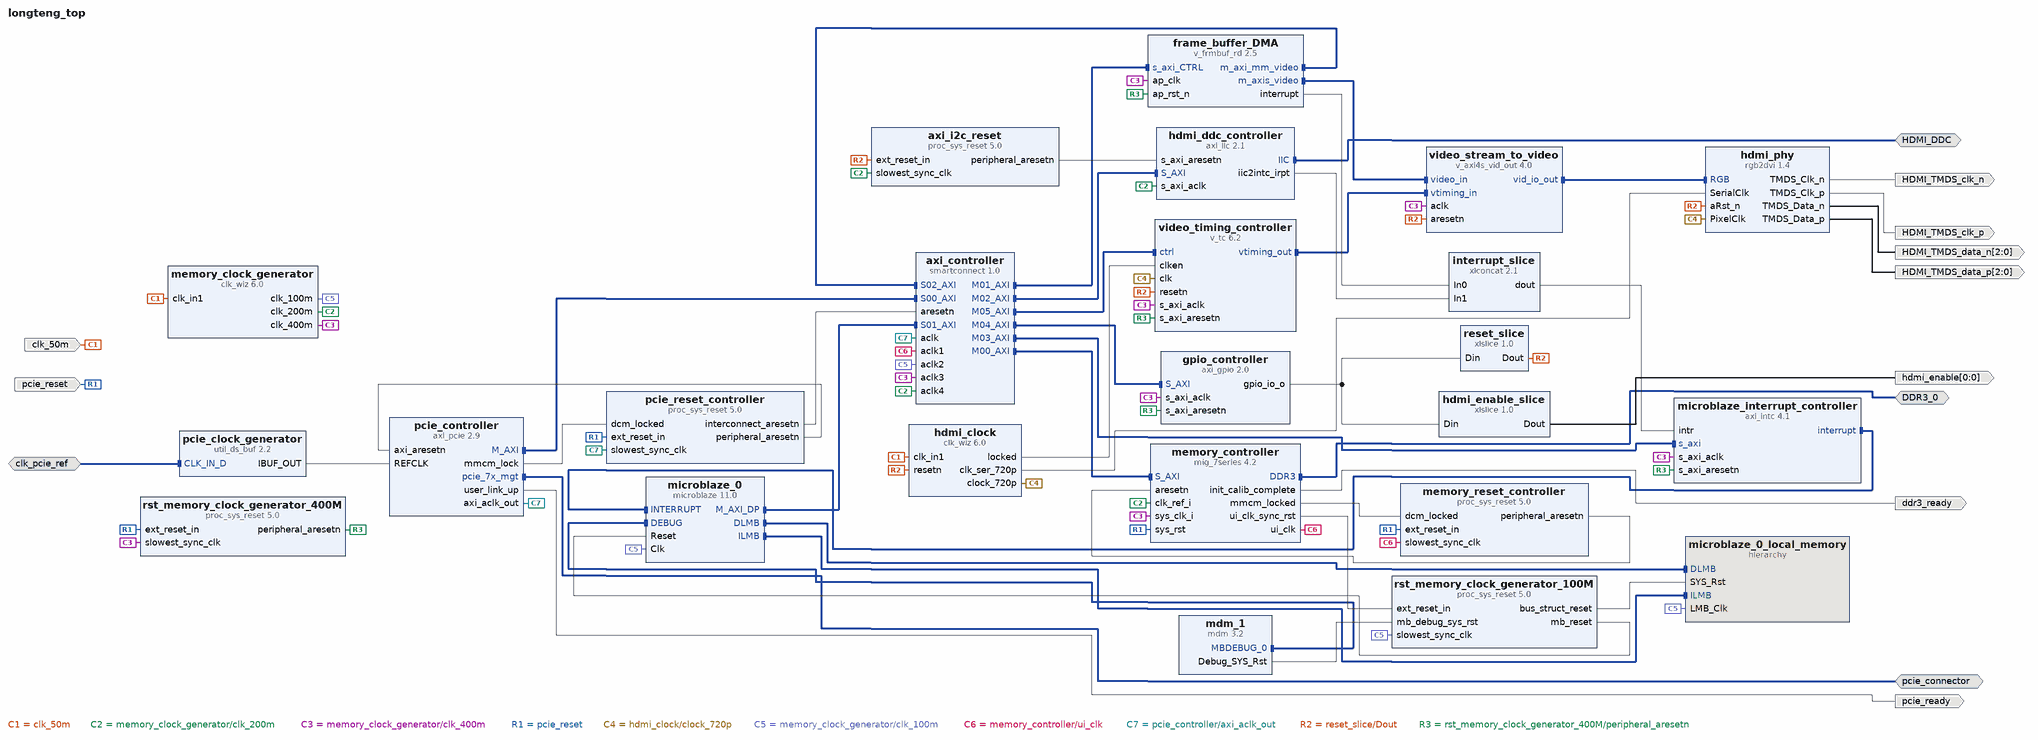
[diagram p0: block diagram of the top level]
# Vivado block design longteng_top, xc7k325tffg676-2, Vivado 2023.2
create_bd_design longteng_top

create_bd_intf_port -mode Slave -vlnv xilinx.com:interface:diff_clock_rtl:1.0 clk_pcie_ref
create_bd_intf_port -mode Master -vlnv xilinx.com:interface:pcie_7x_mgt_rtl:1.0 pcie_connector
create_bd_intf_port -mode Master -vlnv xilinx.com:interface:ddrx_rtl:1.0 DDR3_0
create_bd_intf_port -mode Master -vlnv xilinx.com:interface:iic_rtl:1.0 HDMI_DDC
create_bd_port -dir I -type rst pcie_reset
set_property -dict {CONFIG.POLARITY ACTIVE_LOW} [get_bd_ports pcie_reset]
create_bd_port -dir O pcie_ready
create_bd_port -dir O ddr3_ready
create_bd_port -dir I -type clk clk_50m
set_property -dict {CONFIG.FREQ_HZ 50000000} [get_bd_ports clk_50m]
create_bd_port -dir O -type clk HDMI_TMDS_clk_p
create_bd_port -dir O -type clk HDMI_TMDS_clk_n
create_bd_port -dir O -from 2 -to 0 HDMI_TMDS_data_p
create_bd_port -dir O -from 2 -to 0 HDMI_TMDS_data_n
create_bd_port -dir O -from 0 -to 0 hdmi_enable

create_bd_cell -type ip -vlnv xilinx.com:ip:axi_pcie:2.9 pcie_controller
set_property -dict [list \
  CONFIG.AXIBAR2PCIEBAR_0 0x00000000 \
  CONFIG.AXIBAR_AS_0 true \
  CONFIG.BAR0_SCALE Megabytes \
  CONFIG.BAR0_SIZE 128 \
  CONFIG.BAR_64BIT true \
  CONFIG.BASE_CLASS_MENU Display_controller \
  CONFIG.CLASS_CODE 0x030000 \
  CONFIG.DEVICE_ID 0xbeef \
  CONFIG.ENABLE_CLASS_CODE false \
  CONFIG.INTERRUPT_PIN false \
  CONFIG.MAX_LINK_SPEED 5.0_GT/s \
  CONFIG.M_AXI_DATA_WIDTH 128 \
  CONFIG.NO_OF_LANES X4 \
  CONFIG.NUM_MSI_REQ 1 \
  CONFIG.SUBSYSTEM_ID 0xbabe \
  CONFIG.SUBSYSTEM_VENDOR_ID 0xcafe \
  CONFIG.SUB_CLASS_INTERFACE_MENU VGA_compatible_controller \
  CONFIG.S_AXI_DATA_WIDTH 128 \
  CONFIG.VENDOR_ID 0xf00d \
  CONFIG.enable_jtag_dbg false \
] [get_bd_cells pcie_controller]
create_bd_cell -type ip -vlnv xilinx.com:ip:util_ds_buf:2.2 pcie_clock_generator
set_property -dict {CONFIG.C_BUF_TYPE IBUFDSGTE} [get_bd_cells pcie_clock_generator]
create_bd_cell -type ip -vlnv xilinx.com:ip:smartconnect:1.0 axi_controller
set_property -dict {CONFIG.NUM_CLKS 5 CONFIG.NUM_MI 6 CONFIG.NUM_SI 3} [get_bd_cells axi_controller]
create_bd_cell -type ip -vlnv xilinx.com:ip:mig_7series:4.2 memory_controller
set_property -dict [list \
  CONFIG.BOARD_MIG_PARAM Custom \
  CONFIG.MIG_DONT_TOUCH_PARAM Custom \
  CONFIG.RESET_BOARD_INTERFACE Custom \
  CONFIG.XML_INPUT_FILE mig_a.prj \
] [get_bd_cells memory_controller]
create_bd_cell -type ip -vlnv xilinx.com:ip:clk_wiz:6.0 memory_clock_generator
set_property -dict [list \
  CONFIG.CLKIN1_JITTER_PS 200.0 \
  CONFIG.CLKOUT1_JITTER 126.902 \
  CONFIG.CLKOUT1_PHASE_ERROR 164.985 \
  CONFIG.CLKOUT1_REQUESTED_OUT_FREQ 400.000 \
  CONFIG.CLKOUT2_JITTER 142.107 \
  CONFIG.CLKOUT2_PHASE_ERROR 164.985 \
  CONFIG.CLKOUT2_REQUESTED_OUT_FREQ 200.000 \
  CONFIG.CLKOUT2_USED true \
  CONFIG.CLKOUT3_JITTER 162.035 \
  CONFIG.CLKOUT3_PHASE_ERROR 164.985 \
  CONFIG.CLKOUT3_USED true \
  CONFIG.CLK_OUT1_PORT clk_400m \
  CONFIG.CLK_OUT2_PORT clk_200m \
  CONFIG.CLK_OUT3_PORT clk_100m \
  CONFIG.MMCM_CLKFBOUT_MULT_F 20.000 \
  CONFIG.MMCM_CLKIN1_PERIOD 20.000 \
  CONFIG.MMCM_CLKIN2_PERIOD 10.0 \
  CONFIG.MMCM_CLKOUT0_DIVIDE_F 2.500 \
  CONFIG.MMCM_CLKOUT1_DIVIDE 5 \
  CONFIG.MMCM_CLKOUT2_DIVIDE 10 \
  CONFIG.NUM_OUT_CLKS 3 \
  CONFIG.PRIM_IN_FREQ 50.000 \
  CONFIG.USE_LOCKED false \
  CONFIG.USE_RESET false \
] [get_bd_cells memory_clock_generator]
create_bd_cell -type ip -vlnv xilinx.com:ip:proc_sys_reset:5.0 memory_reset_controller
create_bd_cell -type ip -vlnv xilinx.com:ip:proc_sys_reset:5.0 pcie_reset_controller
create_bd_cell -type ip -vlnv xilinx.com:ip:microblaze:11.0 microblaze_0
set_property -dict [list \
  CONFIG.C_DATA_SIZE 32 \
  CONFIG.C_DEBUG_ENABLED 1 \
  CONFIG.C_D_AXI 1 \
  CONFIG.C_D_LMB 1 \
  CONFIG.C_I_LMB 1 \
  CONFIG.C_USE_BARREL 1 \
  CONFIG.C_USE_DCACHE 0 \
  CONFIG.C_USE_ICACHE 0 \
  CONFIG.G_TEMPLATE_LIST 8 \
] [get_bd_cells microblaze_0]
create_bd_cell -type hier microblaze_0_local_memory
create_bd_cell -type ip -vlnv xilinx.com:ip:mdm:3.2 mdm_1
create_bd_cell -type ip -vlnv xilinx.com:ip:proc_sys_reset:5.0 rst_memory_clock_generator_100M
create_bd_cell -type ip -vlnv xilinx.com:ip:v_frmbuf_rd:2.5 frame_buffer_DMA
set_property -dict [list \
  CONFIG.HAS_ALPHA 1 \
  CONFIG.HAS_BGRA8 1 \
  CONFIG.MAX_COLS 1920 \
  CONFIG.MAX_ROWS 1080 \
] [get_bd_cells frame_buffer_DMA]
create_bd_cell -type ip -vlnv xilinx.com:ip:proc_sys_reset:5.0 rst_memory_clock_generator_400M
create_bd_cell -type ip -vlnv xilinx.com:ip:axi_gpio:2.0 gpio_controller
set_property -dict [list \
  CONFIG.C_ALL_INPUTS 0 \
  CONFIG.C_ALL_OUTPUTS 1 \
  CONFIG.C_DOUT_DEFAULT 0x00000001 \
  CONFIG.C_GPIO_WIDTH 2 \
  CONFIG.C_IS_DUAL 0 \
] [get_bd_cells gpio_controller]
create_bd_cell -type ip -vlnv xilinx.com:ip:v_axi4s_vid_out:4.0 video_stream_to_video
set_property -dict [list \
  CONFIG.C_PIXELS_PER_CLOCK 2 \
  CONFIG.C_S_AXIS_VIDEO_FORMAT 6 \
  CONFIG.C_VTG_MASTER_SLAVE 0 \
] [get_bd_cells video_stream_to_video]
create_bd_cell -type ip -vlnv digilentinc.com:ip:rgb2dvi:1.4 hdmi_phy
set_property -dict {CONFIG.kGenerateSerialClk false CONFIG.kRstActiveHigh false} [get_bd_cells hdmi_phy]
create_bd_cell -type ip -vlnv xilinx.com:ip:axi_iic:2.1 hdmi_ddc_controller
create_bd_cell -type ip -vlnv xilinx.com:ip:axi_intc:4.1 microblaze_interrupt_controller
create_bd_cell -type ip -vlnv xilinx.com:ip:v_tc:6.2 video_timing_controller
set_property -dict [list \
  CONFIG.HAS_INTC_IF false \
  CONFIG.VIDEO_MODE 720p \
  CONFIG.enable_detection false \
  CONFIG.enable_generation true \
  CONFIG.max_clocks_per_line 2048 \
  CONFIG.max_lines_per_frame 2048 \
] [get_bd_cells video_timing_controller]
create_bd_cell -type ip -vlnv xilinx.com:ip:xlslice:1.0 reset_slice
set_property -dict {CONFIG.DIN_WIDTH 2} [get_bd_cells reset_slice]
create_bd_cell -type ip -vlnv xilinx.com:ip:xlconcat:2.1 interrupt_slice
set_property -dict {CONFIG.NUM_PORTS 4} [get_bd_cells interrupt_slice]
create_bd_cell -type ip -vlnv xilinx.com:ip:clk_wiz:6.0 hdmi_clock
set_property -dict [list \
  CONFIG.CLKIN1_JITTER_PS 200.0 \
  CONFIG.CLKOUT1_DRIVES BUFG \
  CONFIG.CLKOUT1_JITTER 462.435 \
  CONFIG.CLKOUT1_PHASE_ERROR 610.813 \
  CONFIG.CLKOUT1_REQUESTED_OUT_FREQ 74.25 \
  CONFIG.CLKOUT2_DRIVES BUFG \
  CONFIG.CLKOUT2_JITTER 372.733 \
  CONFIG.CLKOUT2_PHASE_ERROR 610.813 \
  CONFIG.CLKOUT2_REQUESTED_OUT_FREQ 371.25 \
  CONFIG.CLKOUT2_USED true \
  CONFIG.CLKOUT3_DRIVES BUFG \
  CONFIG.CLKOUT4_DRIVES BUFG \
  CONFIG.CLKOUT5_DRIVES BUFG \
  CONFIG.CLKOUT6_DRIVES BUFG \
  CONFIG.CLKOUT7_DRIVES BUFG \
  CONFIG.CLK_OUT1_PORT clock_720p \
  CONFIG.CLK_OUT2_PORT clk_ser_720p \
  CONFIG.FEEDBACK_SOURCE FDBK_AUTO \
  CONFIG.JITTER_SEL No_Jitter \
  CONFIG.MMCM_BANDWIDTH OPTIMIZED \
  CONFIG.MMCM_CLKFBOUT_MULT_F 59.375 \
  CONFIG.MMCM_CLKIN1_PERIOD 20.000 \
  CONFIG.MMCM_CLKIN2_PERIOD 10.0 \
  CONFIG.MMCM_CLKOUT0_DIVIDE_F 10.000 \
  CONFIG.MMCM_CLKOUT0_DUTY_CYCLE 0.500 \
  CONFIG.MMCM_CLKOUT1_DIVIDE 2 \
  CONFIG.MMCM_COMPENSATION ZHOLD \
  CONFIG.MMCM_DIVCLK_DIVIDE 4 \
  CONFIG.NUM_OUT_CLKS 2 \
  CONFIG.PLL_CLKIN_PERIOD 20.000 \
  CONFIG.PRIMITIVE MMCM \
  CONFIG.PRIM_IN_FREQ 50.000 \
  CONFIG.RESET_PORT resetn \
  CONFIG.RESET_TYPE ACTIVE_LOW \
  CONFIG.USE_LOCKED true \
  CONFIG.USE_MIN_POWER false \
  CONFIG.USE_RESET true \
] [get_bd_cells hdmi_clock]
create_bd_cell -type ip -vlnv xilinx.com:ip:proc_sys_reset:5.0 axi_i2c_reset
create_bd_cell -type ip -vlnv xilinx.com:ip:xlslice:1.0 hdmi_enable_slice
set_property -dict {CONFIG.DIN_TO 1 CONFIG.DIN_WIDTH 2} [get_bd_cells hdmi_enable_slice]

# ---- hierarchy /microblaze_0_local_memory ----
current_bd_instance /microblaze_0_local_memory
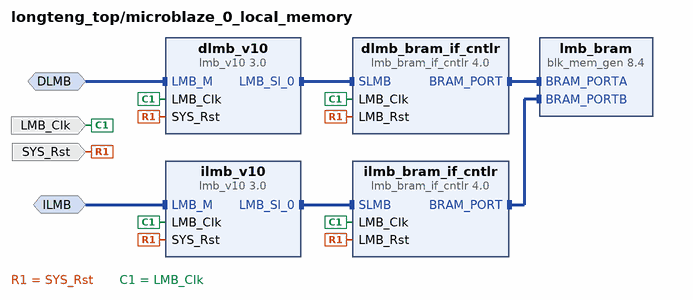
[diagram p1: block diagram inside /microblaze_0_local_memory]
create_bd_intf_pin -mode MirroredMaster -vlnv xilinx.com:interface:lmb_rtl:1.0 DLMB
create_bd_intf_pin -mode MirroredMaster -vlnv xilinx.com:interface:lmb_rtl:1.0 ILMB
create_bd_pin -dir I -type clk LMB_Clk
create_bd_pin -dir I -type rst SYS_Rst

create_bd_cell -type ip -vlnv xilinx.com:ip:lmb_v10:3.0 dlmb_v10
create_bd_cell -type ip -vlnv xilinx.com:ip:lmb_v10:3.0 ilmb_v10
create_bd_cell -type ip -vlnv xilinx.com:ip:lmb_bram_if_cntlr:4.0 dlmb_bram_if_cntlr
set_property -dict {CONFIG.C_ECC 0} [get_bd_cells dlmb_bram_if_cntlr]
create_bd_cell -type ip -vlnv xilinx.com:ip:lmb_bram_if_cntlr:4.0 ilmb_bram_if_cntlr
set_property -dict {CONFIG.C_ECC 0} [get_bd_cells ilmb_bram_if_cntlr]
create_bd_cell -type ip -vlnv xilinx.com:ip:blk_mem_gen:8.4 lmb_bram
set_property -dict {CONFIG.Memory_Type True_Dual_Port_RAM CONFIG.use_bram_block BRAM_Controller} [get_bd_cells lmb_bram]

# ---- connections ----

current_bd_instance /microblaze_0_local_memory
connect_bd_intf_net -intf_net microblaze_0_dlmb [get_bd_intf_pins dlmb_v10/LMB_M] [get_bd_intf_pins DLMB]
connect_bd_intf_net -intf_net microblaze_0_dlmb_bus [get_bd_intf_pins dlmb_v10/LMB_Sl_0] [get_bd_intf_pins dlmb_bram_if_cntlr/SLMB]
connect_bd_intf_net -intf_net microblaze_0_dlmb_cntlr [get_bd_intf_pins dlmb_bram_if_cntlr/BRAM_PORT] [get_bd_intf_pins lmb_bram/BRAM_PORTA]
connect_bd_intf_net -intf_net microblaze_0_ilmb [get_bd_intf_pins ilmb_v10/LMB_M] [get_bd_intf_pins ILMB]
connect_bd_intf_net -intf_net microblaze_0_ilmb_bus [get_bd_intf_pins ilmb_v10/LMB_Sl_0] [get_bd_intf_pins ilmb_bram_if_cntlr/SLMB]
connect_bd_intf_net -intf_net microblaze_0_ilmb_cntlr [get_bd_intf_pins ilmb_bram_if_cntlr/BRAM_PORT] [get_bd_intf_pins lmb_bram/BRAM_PORTB]
connect_bd_net [get_bd_pins SYS_Rst] \
  [get_bd_pins dlmb_v10/SYS_Rst] [get_bd_pins dlmb_bram_if_cntlr/LMB_Rst] [get_bd_pins ilmb_v10/SYS_Rst] \
  [get_bd_pins ilmb_bram_if_cntlr/LMB_Rst]
connect_bd_net -net memory_clock_generator_clk_100m [get_bd_pins LMB_Clk] \
  [get_bd_pins dlmb_v10/LMB_Clk] [get_bd_pins dlmb_bram_if_cntlr/LMB_Clk] [get_bd_pins ilmb_v10/LMB_Clk] \
  [get_bd_pins ilmb_bram_if_cntlr/LMB_Clk]
set_property HDL_ATTRIBUTE.BMM_INFO_ADDRESS_SPACE {byte  0x80000000 32 > longteng_top microblaze_0_local_memory/lmb_bram} [get_bd_cells dlmb_bram_if_cntlr]
set_property HDL_ATTRIBUTE.KEEP_HIERARCHY yes [get_bd_cells dlmb_bram_if_cntlr]

current_bd_instance /
connect_bd_intf_net -intf_net CLK_IN_D_0_1 [get_bd_intf_ports clk_pcie_ref] [get_bd_intf_pins pcie_clock_generator/CLK_IN_D]
connect_bd_intf_net [get_bd_intf_pins axi_controller/M01_AXI] [get_bd_intf_pins frame_buffer_DMA/s_axi_CTRL]
connect_bd_intf_net [get_bd_intf_pins axi_controller/M02_AXI] [get_bd_intf_pins hdmi_ddc_controller/S_AXI]
connect_bd_intf_net [get_bd_intf_pins axi_controller/M03_AXI] [get_bd_intf_pins microblaze_interrupt_controller/s_axi]
connect_bd_intf_net [get_bd_intf_pins axi_controller/M04_AXI] [get_bd_intf_pins gpio_controller/S_AXI]
connect_bd_intf_net [get_bd_intf_pins axi_controller/M05_AXI] [get_bd_intf_pins video_timing_controller/ctrl]
connect_bd_intf_net -intf_net axi_iic_0_IIC [get_bd_intf_ports HDMI_DDC] [get_bd_intf_pins hdmi_ddc_controller/IIC]
connect_bd_intf_net -intf_net axi_intc_0_interrupt [get_bd_intf_pins microblaze_interrupt_controller/interrupt] [get_bd_intf_pins microblaze_0/INTERRUPT]
connect_bd_intf_net [get_bd_intf_pins frame_buffer_DMA/m_axi_mm_video] [get_bd_intf_pins axi_controller/S02_AXI]
connect_bd_intf_net [get_bd_intf_pins frame_buffer_DMA/m_axis_video] [get_bd_intf_pins video_stream_to_video/video_in]
connect_bd_intf_net [get_bd_intf_pins microblaze_0/M_AXI_DP] [get_bd_intf_pins axi_controller/S01_AXI]
connect_bd_intf_net [get_bd_intf_pins mdm_1/MBDEBUG_0] [get_bd_intf_pins microblaze_0/DEBUG]
connect_bd_intf_net [get_bd_intf_pins microblaze_0/DLMB] [get_bd_intf_pins microblaze_0_local_memory/DLMB]
connect_bd_intf_net [get_bd_intf_pins microblaze_0/ILMB] [get_bd_intf_pins microblaze_0_local_memory/ILMB]
connect_bd_intf_net -intf_net mig_7series_0_DDR3 [get_bd_intf_ports DDR3_0] [get_bd_intf_pins memory_controller/DDR3]
connect_bd_intf_net [get_bd_intf_pins axi_controller/S00_AXI] [get_bd_intf_pins pcie_controller/M_AXI]
connect_bd_intf_net [get_bd_intf_ports pcie_connector] [get_bd_intf_pins pcie_controller/pcie_7x_mgt]
connect_bd_intf_net -intf_net smartconnect_0_M00_AXI [get_bd_intf_pins axi_controller/M00_AXI] [get_bd_intf_pins memory_controller/S_AXI]
connect_bd_intf_net -intf_net v_axi4s_vid_out_0_vid_io_out [get_bd_intf_pins video_stream_to_video/vid_io_out] [get_bd_intf_pins hdmi_phy/RGB]
connect_bd_intf_net -intf_net v_tc_0_vtiming_out [get_bd_intf_pins video_stream_to_video/vtiming_in] [get_bd_intf_pins video_timing_controller/vtiming_out]
connect_bd_net [get_bd_pins axi_i2c_reset/peripheral_aresetn] [get_bd_pins hdmi_ddc_controller/s_axi_aresetn]
connect_bd_net -net axi_iic_0_iic2intc_irpt [get_bd_pins hdmi_ddc_controller/iic2intc_irpt] [get_bd_pins interrupt_slice/In1]
connect_bd_net -net clk_in1_0_1 [get_bd_ports clk_50m] [get_bd_pins memory_clock_generator/clk_in1] [get_bd_pins hdmi_clock/clk_in1]
connect_bd_net -net clk_wiz_0_clk_200m [get_bd_pins memory_clock_generator/clk_200m] \
  [get_bd_pins memory_controller/clk_ref_i] [get_bd_pins hdmi_ddc_controller/s_axi_aclk] [get_bd_pins axi_controller/aclk4] \
  [get_bd_pins axi_i2c_reset/slowest_sync_clk]
connect_bd_net -net clk_wiz_0_clk_400m [get_bd_pins memory_clock_generator/clk_400m] \
  [get_bd_pins memory_controller/sys_clk_i] [get_bd_pins frame_buffer_DMA/ap_clk] [get_bd_pins axi_controller/aclk3] \
  [get_bd_pins rst_memory_clock_generator_400M/slowest_sync_clk] [get_bd_pins microblaze_interrupt_controller/s_axi_aclk] \
  [get_bd_pins gpio_controller/s_axi_aclk] [get_bd_pins video_stream_to_video/aclk] \
  [get_bd_pins video_timing_controller/s_axi_aclk]
connect_bd_net -net ext_reset_in_0_1 [get_bd_ports pcie_reset] \
  [get_bd_pins memory_reset_controller/ext_reset_in] [get_bd_pins pcie_reset_controller/ext_reset_in] \
  [get_bd_pins memory_controller/sys_rst] [get_bd_pins rst_memory_clock_generator_400M/ext_reset_in]
connect_bd_net [get_bd_pins frame_buffer_DMA/interrupt] [get_bd_pins interrupt_slice/In0]
connect_bd_net [get_bd_pins gpio_controller/gpio_io_o] [get_bd_pins reset_slice/Din] [get_bd_pins hdmi_enable_slice/Din]
connect_bd_net [get_bd_pins hdmi_clock/clk_ser_720p] [get_bd_pins hdmi_phy/SerialClk]
connect_bd_net [get_bd_pins hdmi_clock/clock_720p] [get_bd_pins hdmi_phy/PixelClk] [get_bd_pins video_timing_controller/clk]
connect_bd_net [get_bd_pins hdmi_clock/locked] [get_bd_pins video_timing_controller/clken]
connect_bd_net [get_bd_pins hdmi_enable_slice/Dout] [get_bd_ports hdmi_enable]
connect_bd_net [get_bd_pins mdm_1/Debug_SYS_Rst] [get_bd_pins rst_memory_clock_generator_100M/mb_debug_sys_rst]
connect_bd_net [get_bd_pins memory_clock_generator/clk_100m] \
  [get_bd_pins microblaze_0/Clk] [get_bd_pins microblaze_0_local_memory/LMB_Clk] \
  [get_bd_pins rst_memory_clock_generator_100M/slowest_sync_clk] [get_bd_pins axi_controller/aclk2]
connect_bd_net [get_bd_pins memory_controller/ui_clk_sync_rst] [get_bd_pins rst_memory_clock_generator_100M/ext_reset_in]
connect_bd_net -net mig_7series_0_init_calib_complete [get_bd_pins memory_controller/init_calib_complete] [get_bd_ports ddr3_ready]
connect_bd_net -net mig_7series_0_mmcm_locked [get_bd_pins memory_controller/mmcm_locked] [get_bd_pins memory_reset_controller/dcm_locked]
connect_bd_net -net mig_7series_0_ui_clk [get_bd_pins memory_controller/ui_clk] \
  [get_bd_pins axi_controller/aclk1] [get_bd_pins memory_reset_controller/slowest_sync_clk]
connect_bd_net [get_bd_pins pcie_controller/axi_aclk_out] [get_bd_pins axi_controller/aclk] [get_bd_pins pcie_reset_controller/slowest_sync_clk]
connect_bd_net [get_bd_pins pcie_controller/mmcm_lock] [get_bd_pins pcie_reset_controller/dcm_locked]
connect_bd_net [get_bd_pins pcie_controller/user_link_up] [get_bd_ports pcie_ready]
connect_bd_net -net proc_sys_reset_0_peripheral_aresetn [get_bd_pins memory_reset_controller/peripheral_aresetn] \
  [get_bd_pins memory_controller/aresetn]
connect_bd_net -net proc_sys_reset_1_interconnect_aresetn [get_bd_pins pcie_reset_controller/interconnect_aresetn] \
  [get_bd_pins axi_controller/aresetn]
connect_bd_net -net proc_sys_reset_1_peripheral_aresetn [get_bd_pins pcie_reset_controller/peripheral_aresetn] \
  [get_bd_pins pcie_controller/axi_aresetn]
connect_bd_net [get_bd_pins reset_slice/Dout] \
  [get_bd_pins video_stream_to_video/aresetn] [get_bd_pins hdmi_phy/aRst_n] [get_bd_pins video_timing_controller/resetn] \
  [get_bd_pins hdmi_clock/resetn] [get_bd_pins axi_i2c_reset/ext_reset_in]
connect_bd_net -net rgb2dvi_0_TMDS_Clk_n [get_bd_pins hdmi_phy/TMDS_Clk_n] [get_bd_ports HDMI_TMDS_clk_n]
connect_bd_net -net rgb2dvi_0_TMDS_Clk_p [get_bd_pins hdmi_phy/TMDS_Clk_p] [get_bd_ports HDMI_TMDS_clk_p]
connect_bd_net -net rgb2dvi_0_TMDS_Data_n [get_bd_pins hdmi_phy/TMDS_Data_n] [get_bd_ports HDMI_TMDS_data_n]
connect_bd_net -net rgb2dvi_0_TMDS_Data_p [get_bd_pins hdmi_phy/TMDS_Data_p] [get_bd_ports HDMI_TMDS_data_p]
connect_bd_net [get_bd_pins rst_memory_clock_generator_100M/bus_struct_reset] [get_bd_pins microblaze_0_local_memory/SYS_Rst]
connect_bd_net [get_bd_pins rst_memory_clock_generator_100M/mb_reset] [get_bd_pins microblaze_0/Reset]
connect_bd_net [get_bd_pins rst_memory_clock_generator_400M/peripheral_aresetn] \
  [get_bd_pins frame_buffer_DMA/ap_rst_n] [get_bd_pins microblaze_interrupt_controller/s_axi_aresetn] \
  [get_bd_pins gpio_controller/s_axi_aresetn] [get_bd_pins video_timing_controller/s_axi_aresetn]
connect_bd_net -net util_ds_buf_0_IBUF_OUT [get_bd_pins pcie_clock_generator/IBUF_OUT] [get_bd_pins pcie_controller/REFCLK]
connect_bd_net -net xlconcat_0_dout [get_bd_pins interrupt_slice/dout] [get_bd_pins microblaze_interrupt_controller/intr]
set_property HDL_ATTRIBUTE.BMM_INFO_PROCESSOR {microblaze-le > longteng_top microblaze_0_local_memory/dlmb_bram_if_cntlr} [get_bd_cells microblaze_0]
set_property HDL_ATTRIBUTE.KEEP_HIERARCHY yes [get_bd_cells microblaze_0]

# ---- address map ----
assign_bd_address -offset 0x00000000 -range 1G -target_address_space [get_bd_addr_spaces frame_buffer_DMA/Data_m_axi_mm_video] [get_bd_addr_segs memory_controller/memmap/memaddr]
exclude_bd_addr_seg -offset 0x40000000 -range 64K -target_address_space [get_bd_addr_spaces frame_buffer_DMA/Data_m_axi_mm_video] [get_bd_addr_segs gpio_controller/S_AXI/Reg]
exclude_bd_addr_seg -offset 0x40800000 -range 64K -target_address_space [get_bd_addr_spaces frame_buffer_DMA/Data_m_axi_mm_video] [get_bd_addr_segs hdmi_ddc_controller/S_AXI/Reg]
exclude_bd_addr_seg -offset 0x41200000 -range 64K -target_address_space [get_bd_addr_spaces frame_buffer_DMA/Data_m_axi_mm_video] [get_bd_addr_segs microblaze_interrupt_controller/S_AXI/Reg]
exclude_bd_addr_seg -offset 0x44A00000 -range 64K -target_address_space [get_bd_addr_spaces frame_buffer_DMA/Data_m_axi_mm_video] [get_bd_addr_segs frame_buffer_DMA/s_axi_CTRL/Reg]
exclude_bd_addr_seg -offset 0x44A10000 -range 64K -target_address_space [get_bd_addr_spaces frame_buffer_DMA/Data_m_axi_mm_video] [get_bd_addr_segs video_timing_controller/ctrl/Reg]
assign_bd_address -offset 0x00000000 -range 1G -target_address_space [get_bd_addr_spaces microblaze_0/Data] [get_bd_addr_segs memory_controller/memmap/memaddr]
assign_bd_address -offset 0x40000000 -range 64K -target_address_space [get_bd_addr_spaces microblaze_0/Data] [get_bd_addr_segs gpio_controller/S_AXI/Reg]
assign_bd_address -offset 0x40800000 -range 64K -target_address_space [get_bd_addr_spaces microblaze_0/Data] [get_bd_addr_segs hdmi_ddc_controller/S_AXI/Reg]
assign_bd_address -offset 0x41200000 -range 64K -target_address_space [get_bd_addr_spaces microblaze_0/Data] [get_bd_addr_segs microblaze_interrupt_controller/S_AXI/Reg]
assign_bd_address -offset 0x44A00000 -range 64K -target_address_space [get_bd_addr_spaces microblaze_0/Data] [get_bd_addr_segs frame_buffer_DMA/s_axi_CTRL/Reg]
assign_bd_address -offset 0x44A10000 -range 64K -target_address_space [get_bd_addr_spaces microblaze_0/Data] [get_bd_addr_segs video_timing_controller/ctrl/Reg]
assign_bd_address -offset 0x80000000 -range 8K -target_address_space [get_bd_addr_spaces microblaze_0/Data] [get_bd_addr_segs microblaze_0_local_memory/dlmb_bram_if_cntlr/SLMB/Mem]
assign_bd_address -offset 0x80002000 -range 8K -target_address_space [get_bd_addr_spaces microblaze_0/Instruction] [get_bd_addr_segs microblaze_0_local_memory/ilmb_bram_if_cntlr/SLMB/Mem]
assign_bd_address -offset 0x00000000 -range 1G -target_address_space [get_bd_addr_spaces pcie_controller/M_AXI] [get_bd_addr_segs memory_controller/memmap/memaddr]
assign_bd_address -offset 0x40000000 -range 64K -target_address_space [get_bd_addr_spaces pcie_controller/M_AXI] [get_bd_addr_segs gpio_controller/S_AXI/Reg]
assign_bd_address -offset 0x40800000 -range 64K -target_address_space [get_bd_addr_spaces pcie_controller/M_AXI] [get_bd_addr_segs hdmi_ddc_controller/S_AXI/Reg]
assign_bd_address -offset 0x41200000 -range 64K -target_address_space [get_bd_addr_spaces pcie_controller/M_AXI] [get_bd_addr_segs microblaze_interrupt_controller/S_AXI/Reg]
assign_bd_address -offset 0x44A00000 -range 64K -target_address_space [get_bd_addr_spaces pcie_controller/M_AXI] [get_bd_addr_segs frame_buffer_DMA/s_axi_CTRL/Reg]
assign_bd_address -offset 0x44A10000 -range 64K -target_address_space [get_bd_addr_spaces pcie_controller/M_AXI] [get_bd_addr_segs video_timing_controller/ctrl/Reg]

validate_bd_design
save_bd_design
